# Altium schematic sheet Non_Inverting_OpAmp.SchDoc
size A; SheetNumber: 1; SheetTotal: 1
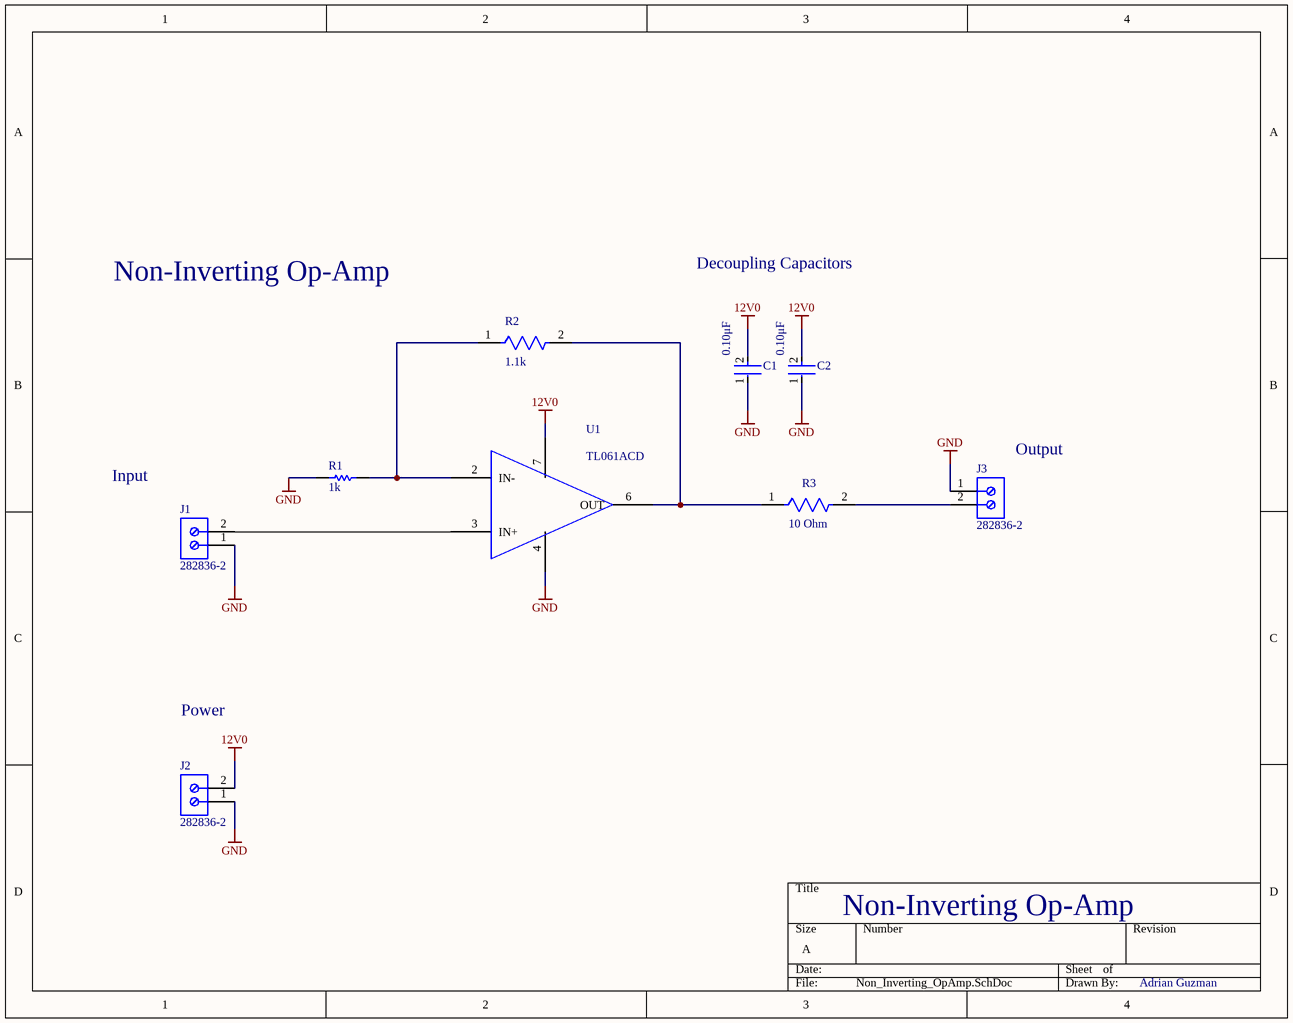
[diagram p0: Non_Inverting_OpAmp.SchDoc]

## Parts
C1  Capacitance: 0.10μF  [FP-GRM15-MFG]  (hidden comment: GRM155R71C104KA88D)
C2  Capacitance: 0.10μF  [FP-GRM15-MFG]  (hidden comment: GRM155R71C104KA88D)
J1  282836-2  [TECO-282836-2_V]
J2  282836-2  [TECO-282836-2_V]
J3  282836-2  [TECO-282836-2_V]
R1  Resistance: 1k  [RESC1608X55X30LL15T15]  (hidden comment: ERJ-3EKF1001V)
R2  Resistance: 1.1k  [FP-MCR03-IPC_B]  (hidden comment: MCR03EZPFX1101)
R3  Resistance: 10 Ohm  [FP-CRCW0603-e3-IPC_A]  (hidden comment: CRCW060310R0FKEA)
U1  TL061ACD  [TL061ACD]

## Nets
12V0: C1.2 C2.2 J2.2 U1.7(VCC+)
GND: C1.1 C2.1 J1.1 J2.1 J3.1 R1.2 U1.4(VCC-)
NetJ1_2: J1.2 U1.3(IN+)
NetJ3_2: J3.2 R3.2
NetR1_1: R1.1 R2.1 U1.2(IN-)
NetR2_2: R2.2 R3.1 U1.6(OUT)

## Notes on the sheet
- Non-Inverting Op-Amp
- Decoupling Capacitors
- Input
- (near J3) Output
- Power
- Adrian Guzman

## Library data of the parts
C1 C2 = CMP-2100-03641-2: CAP CER 0.1UF 16V X7R 0402; Manufacturer: Murata; Standoff Height: 0mm; Tolerance: 10%; Voltage Rating: 16Vdc; Material: Ceramic; Value: 0.10μF; RoHS: TRUE; Manufacturer Part Number: GRM155R71C104KA88D; Temperature Characteristic: X7R; Octopart: https://octopart.com/grm155r71c104ka88d-murata-196880; Digikey Description: CAP CER 0.1UF 16V X7R 0402; Device Class L3: Ceramic Capacitors; Height: 0.55mm; ComponentLink2Description: Datasheet; Temperature Range Low: -55°C; Ipc Land Pattern Name: CAPC10050X219; ComponentLink2URL: https://search.murata.co.jp/Ceramy/image/img/A01X/G101/ENG/GRM155R71H471KA01-01A.pdf; Device Class L1: Passive Components; Lead Free: yes; Category: Cap; Package: GRM15; Temperature: -55°C to +125°C; Device Class L2: Capacitors; Temperature Range High: +125°C; Mouser Description: 0402 0.1 uF 16V ±10 % Tolerance X7R SMT Multilayer Ceramic Capacitor
J1-J3 = CMP-1684-00017-1: Female Header, Pitch 5 mm, 1 x 2 Position, Height 10 mm, Tail Length 3.5 mm, Rohs, Bulk; Manufacturer: TE Connectivity; Wire Gauge: 16-30AWG; Product Training Modules: Wire-to-BoardEurostyleTerminalBlocks; Clamp Material - Plating: Brass-NickelPlated; Voltage: 300V; Mating Orientation: HorizontalwithBoard; Current: 13.5A; Pitch: 0.197"(5.00mm); Screw Thread: M3; 3D Model: 282836-2.pdf; Other Names: 5ULV-02B / A98076; Dynamic Catalog: BuchananSeries; Number of Levels: 1; Torque - Screw: 0.68Nm(6Lb-In); Featured Product: EurostyleTerminalBlockConnectors; Positions Per Level: 2; Wire Termination: Screw-RisingCageClamp; Datasheet URL: http://www.te.com.cn/commerce/DocumentDelivery/DDEController?Action=showdoc&DocId=Catalog+Section%7F1308389_EUROSTYLE_TERMINAL_BLOCKS%7F0607%7Fpdf%7FEnglish%7FENG_CS_1308389_EUROSTYLE_TERMINAL_BLOCKS_0607.pdf%7F282836-2; Color: Green; Family: TerminalBlocks-WiretoBoard; RoHS Information: 282836-2StatementofCompliance; Standard Package: 300; Contact Material - Plating: Brass-TinPlated; Manufacturer URL: http://www.te.com; Housing Material: Polyamide(PA66),Nylon6/6; Features: Interlocking(Side); Package Description: Female Header, Pitch 5 mm, 1 x 2 Position, Height 10 mm, Tail Length 3.5 mm; Mounting Type: ThroughHole; Package Reference: THD; Packaging: Bulk; Series: Buchanan; Category: Connectors,Interconnects; Screw Material - Plating: Brass-NickelPlated
R1 = CMP-2000-00180-1: Manufacturer: Panasonic; Part Number: ERJ-3EKF1001V
R2 = CMP-08839-006227-1: Thick Film Chip Resistor, 0603, 1.1kΩ, 1%, 100ppm/°C, 0.1W, 50V; Power Rating: 100mW; Min Operating Temperature: -55°C; Case/Package: 0603; Lead Free: Lead Free; Case Code (Imperial): 0603; Package Quantity: 5000; Case Code (Metric): 1608; Contact Plating: Tin; Mount: Surface Mount; Temperature Coefficient: 100ppm/°C; Height: 0.022inch; Max Operating Temperature: 155°C; Resistor Type: Thick Film; Military Standard: Not; Width: 0.031inch; Voltage Rating (DC): 50V; Features: Automotive AEC-Q200; Length: 0.063inch; Number of Terminations: 2; RoHS Compliant: Yes; Tolerance: 1%; Packaging: Tape and Reel; Depth: 0.8mm; Max Power Dissipation: 100mW
R3 = CMP-2000-03845-2: RES Thick Film, 10Ω, 1%, 0.1W, 100ppm/°C, 0603; Voltage Rating (DC): 75V; Power Rating: 100mW; Depth: 0.85mm; Height: 0.45mm; Package Quantity: 10; Temperature Coefficient: 100ppm/°C; Weight: 7.1E-05oz; Case Code (Metric): 1608; Number of Terminations: 2; Features: Automotive AEC-Q200; Termination: SMD/SMT; Lead Free: Lead Free; Mount: Surface Mount; Number of Pins: 2; Tolerance: 1%; Max Power Dissipation: 100mW; Width: 0.033inch; Contact Plating: Tin; Case Code (Imperial): 0603; Max Operating Temperature: 155°C; Min Operating Temperature: -55°C; Voltage Rating: 75V; Length: 1.55mm; Case/Package: 0603; Composition: Thick Film; Packaging: Tape and Reel; Military Standard: Not
U1 = TL061ACD: TL061ACD Op-Amp